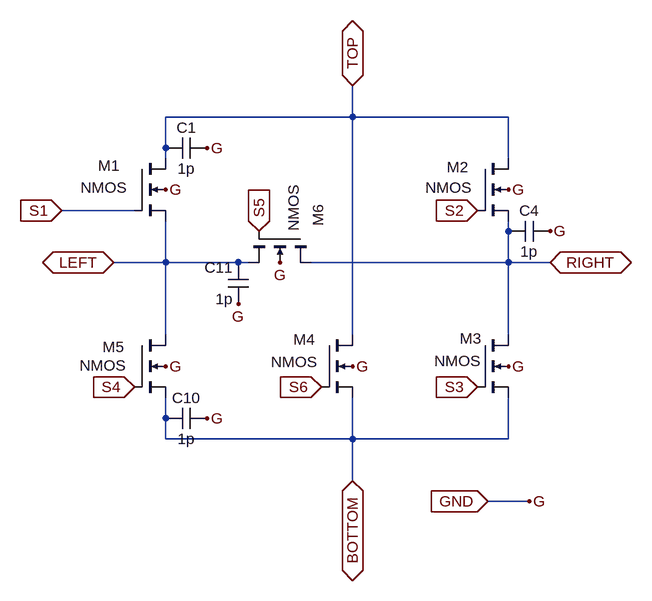
[diagram p0: schematic switch_matrix.asc]
switch_matrix.asc, the LTspice schematic file:
Version 4
SHEET 1 1064 680
WIRE 624 -160 624 -208
WIRE 624 -160 336 -160
WIRE 864 -160 624 -160
WIRE 336 -112 336 -160
WIRE 336 -96 336 -112
WIRE 864 -96 864 -160
WIRE 288 -16 176 -16
WIRE 864 16 864 0
WIRE 336 64 336 0
WIRE 336 64 256 64
WIRE 448 64 336 64
WIRE 464 64 448 64
WIRE 864 64 864 16
WIRE 864 64 560 64
WIRE 928 64 864 64
WIRE 336 176 336 64
WIRE 624 176 624 -160
WIRE 864 176 864 64
WIRE 336 304 336 272
WIRE 336 336 336 304
WIRE 624 336 624 272
WIRE 624 336 336 336
WIRE 864 336 864 272
WIRE 864 336 624 336
WIRE 624 400 624 336
WIRE 896 432 832 432
FLAG 624 -208 TOP
IOPIN 624 -208 BiDir
FLAG 624 400 BOTTOM
IOPIN 624 400 BiDir
FLAG 256 64 LEFT
IOPIN 256 64 BiDir
FLAG 928 64 RIGHT
IOPIN 928 64 BiDir
FLAG 832 432 GND
IOPIN 832 432 In
FLAG 896 432 G
FLAG 336 -48 G
FLAG 400 -112 G
FLAG 512 64 G
FLAG 448 128 G
FLAG 624 224 G
FLAG 336 224 G
FLAG 400 304 G
FLAG 864 224 G
FLAG 928 16 G
FLAG 864 -48 G
FLAG 176 -16 S1
IOPIN 176 -16 In
FLAG 816 -16 S2
IOPIN 816 -16 In
FLAG 816 256 S3
IOPIN 816 256 In
FLAG 288 256 S4
IOPIN 288 256 In
FLAG 480 16 S5
IOPIN 480 16 In
FLAG 576 256 S6
IOPIN 576 256 In
SYMBOL nmos4 288 -96 R0
WINDOW 0 -56 11 Left 2
WINDOW 3 -83 45 Left 2
SYMATTR InstName M1
SYMBOL nmos4 816 -96 R0
WINDOW 0 -47 13 Left 2
WINDOW 3 -80 45 Left 2
SYMATTR InstName M2
SYMBOL nmos4 816 176 R0
WINDOW 0 -27 5 Left 2
WINDOW 3 -66 40 Left 2
SYMATTR InstName M3
SYMBOL nmos4 576 176 R0
WINDOW 0 -43 7 Left 2
WINDOW 3 -78 41 Left 2
SYMATTR InstName M4
SYMBOL nmos4 288 176 R0
WINDOW 0 -49 18 Left 2
WINDOW 3 -84 47 Left 2
SYMATTR InstName M5
SYMBOL nmos4 560 16 R90
WINDOW 0 -41 -11 Left 2
WINDOW 3 -72 27 Left 2
SYMATTR InstName M6
SYMBOL cap 400 -128 R90
WINDOW 0 0 32 VBottom 2
WINDOW 3 32 32 VTop 2
SYMATTR InstName C1
SYMATTR Value 1p
SYMBOL cap 928 0 R90
WINDOW 0 0 32 VBottom 2
WINDOW 3 32 32 VTop 2
SYMATTR InstName C4
SYMATTR Value 1p
SYMBOL cap 400 288 R90
WINDOW 0 0 32 VBottom 2
WINDOW 3 32 32 VTop 2
SYMATTR InstName C10
SYMATTR Value 1p
SYMBOL cap 464 128 R180
WINDOW 0 24 56 Left 2
WINDOW 3 24 8 Left 2
SYMATTR InstName C11
SYMATTR Value 1p

The netlist it stands for:
* switch_matrix.asc
M1 TOP S1 LEFT G NMOS
M2 TOP S2 RIGHT G NMOS
M3 RIGHT S3 BOTTOM G NMOS
M4 TOP S6 BOTTOM G NMOS
M5 LEFT S4 BOTTOM G NMOS
M6 RIGHT S5 LEFT G NMOS
C1 G TOP 1p
C4 G RIGHT 1p
C10 G BOTTOM 1p
C11 G LEFT 1p
.model NMOS NMOS
.model PMOS PMOS
.lib standard.mos
.backanno
.end